# Altium schematic sheet Cooling_Control_2.SchDoc
size A4; SheetNumber: 7; SheetTotal: 7
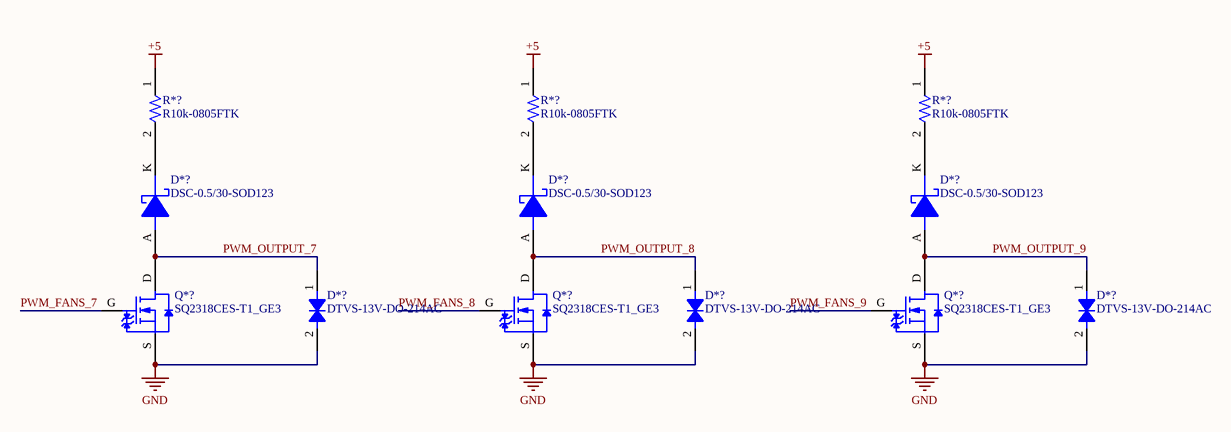
[diagram p0: Cooling_Control_2.SchDoc]

## Parts
(Parts that share a designator on the sheet are numbered #1, #2 ... from top to bottom, then left to right.)
D*?#1  DSC-0.5/30-SOD123  [DSC-SOD123]
D*?#2  DSC-0.5/30-SOD123  [DSC-SOD123]
D*?#3  DSC-0.5/30-SOD123  [DSC-SOD123]
D*?#4  DTVS-13V-DO-214AC  [DTVS-DO-214AC]
D*?#5  DTVS-13V-DO-214AC  [DTVS-DO-214AC]
D*?#6  DTVS-13V-DO-214AC  [DTVS-DO-214AC]
Q*?#1  SQ2318CES-T1_GE3  [SOT95P245X110-3N]
Q*?#2  SQ2318CES-T1_GE3  [SOT95P245X110-3N]
Q*?#3  SQ2318CES-T1_GE3  [SOT95P245X110-3N]
R*?#1  R10k-0805FTK  [R0805FTK]
R*?#2  R10k-0805FTK  [R0805FTK]
R*?#3  R10k-0805FTK  [R0805FTK]

## Nets
+5: R*?#1.1 R*?#2.1 R*?#3.1
GND: D*?#4.2 D*?#5.2 D*?#6.2 Q*?#1.S Q*?#2.S Q*?#3.S
PWM_FANS_7: Q*?#1.G
PWM_FANS_8: Q*?#2.G
PWM_FANS_9: Q*?#3.G
PWM_OUTPUT_7: D*?#1.A D*?#4.1 Q*?#1.D
PWM_OUTPUT_8: D*?#2.A D*?#5.1 Q*?#2.D
PWM_OUTPUT_9: D*?#3.A D*?#6.1 Q*?#3.D
NetD*?#1_K: D*?#1.K R*?#1.2
NetD*?#2_K: D*?#2.K R*?#2.2
NetD*?#3_K: D*?#3.K R*?#3.2

## Library data of the parts
D*?#1-D*?#3 = CMP-00165-1: VR=30V IF=500mA 30pF P=410mW; Max Reverse Leakage Current: 130uA; .Creator: GP; Max Reverse Voltage (DC): 30V; Element Configuration: Single; Average Rectified Current: 500mA; Peak Non-Repetitive Surge Current: 5.5A; Polarity: Standard; Forward Voltage: 430mV; ComponentLink10Description: https://datasheet.ciiva.com/910/mbr0530-910518.pdf?src-supplier=Digi-Key; ComponentLink1Description: Datasheet; Category: Diode; ComponentLink3Description: https://datasheet.ciiva.com/30479/0900766b810e2512-30479401.pdf?src-supplier=RSComponents; ComponentLink5Description: https://datasheet.ciiva.com/910/mbr0530-910516.pdf?src-supplier=Digi-Key; Stock 1: 9; Weight: 0.03g; Source: Filter components.SchLib; ComponentLink2Description: Where buy it; Series: -; Mount: Surface Mount; Max Repetitive Reverse Voltage (Vrrm): 30V; Pricing 1: 1=0,34400, 10=0,23900, 100=0,12200, 500=0,10000 (USD); Design Item ID: DSC-0.5/30-SOD123; ComponentLink8Description: https://datasheet.ciiva.com/17318/mbr0530-17318568.pdf?src-supplier=Future+Electronics; Current Rating: 500mA; ComponentLink1URL: *; Length: 2.7mm; Max Reverse Current: 130uA; ComponentLink7URL: https://datasheet.ciiva.com/8300/mbr0530-8300905.pdf?src-supplier=Avnet; ComponentLink9URL: https://datasheet.ciiva.com/15144/getdatasheetpartid-86760-15144598.pdf?src-supplier=Verical; Radiation Hardening: No; Height: 1.03mm; ComponentLink4Description: https://datasheet.ciiva.com/34301/974753-34301826.pdf?src-supplier=Jameco; ComponentLink7Description: https://datasheet.ciiva.com/8300/mbr0530-8300905.pdf?src-supplier=Avnet; Package Quantity: 1; Forward Current: 500mA; ComponentLink5URL: https://datasheet.ciiva.com/910/mbr0530-910516.pdf?src-supplier=Digi-Key; Max Surge Current: 5.5A; Lead Free: Lead Free; ComponentLink2URL: *; Max Forward Surge Current (Ifsm): 5.5A; Output Current: 500mA; Voltage Rating (DC): 30V; Contact Plating: Tin,Matte; RoHS Compliant: Yes; REACH SVHC: No SVHC; ComponentLink10URL: https://datasheet.ciiva.com/910/mbr0530-910518.pdf?src-supplier=Digi-Key; ComponentLink4URL: https://datasheet.ciiva.com/34301/974753-34301826.pdf?src-supplier=Jameco; ComponentLink6URL: https://datasheet.ciiva.com/25931/mbr0530-25931989.pdf?src-supplier=Avnet+Europe; ComponentLink6Description: https://datasheet.ciiva.com/25931/mbr0530-25931989.pdf?src-supplier=Avnet+Europe; Width: 1.6mm; ComponentLink3URL: https://datasheet.ciiva.com/30479/0900766b810e2512-30479401.pdf?src-supplier=RSComponents; ComponentLink9Description: https://datasheet.ciiva.com/15144/getdatasheetpartid-86760-15144598.pdf?src-supplier=Verical; ComponentLink8URL: https://datasheet.ciiva.com/17318/mbr0530-17318568.pdf?src-supplier=Future+Electronics
D*?#4-D*?#6 = CMP-00155-1: Tvs Diode, 400W, 13V, Bidir, DO-214AC; Manufacturer Part Number: 824501131; Manufacturer: Wurth Electronics; Peak Pulse Current: 18.6A; Power Line Protection: No; .Creator: DO; Forward Voltage: 15.15V; Polarity: Bidirectional; Number of Bidirectional Channels: 1; Clamping Voltage: 21.5V; Max Operating Temperature: 150°C; Category: TVS Diodes; Stock 1: 1000; RoHS: Yes; ComponentLink3Description: Where buy it; Source: Filter components.SchLib; Design Item ID: DTVS-13V-DO-214AC; REACH SVHC: Unknown; Min Operating Temperature: -65°C; Resistor Type: Zener; ComponentLink2Description: http://www.farnell.com/datasheets/2036399.pdf?src-supplier=Element14; Peak Pulse Power: 400W; ComponentLink1URL: https://katalog.we-online.de/pbs/datasheet/824501131.pdf?src-supplier=Digi-Key; Packaging: Cut Tape; ComponentLink2URL: http://www.farnell.com/datasheets/2036399.pdf?src-supplier=Element14; ComponentLink3URL: https://www.we-online.com/catalog/en/WE-TVSP?sq=824501131#824501131; RoHS Compliant: Yes; Reverse Standoff Voltage: 13V; Mount: Surface Mount; Min Breakdown Voltage: 15.15V; ComponentLink1Description: https://katalog.we-online.de/pbs/datasheet/824501131.pdf?src-supplier=Digi-Key; Pricing 1: 1=0,27000 (USD); Pins: 2
Q*?#1-Q*?#3 = CMP-013-00002-1: Mosfet, N-channel, 40V, 7A, SOT-23 Rohs Compliant: Yes
R*?#1-R*?#3 = CMP-00085-1: BOURNS         CR0805-JW-103ELF            Surface Mount Chip Resistor, Thick Film, CR Series, 10 kohm, 125 mW,  5%, 150 V; .Creator: DR; Power Rating: 125mW; Voltage Rating (DC): 100V; Voltage Rating: 150V; Temperature Coefficient: 200ppm/°C; Value: 10k; ComponentLink6URL: https://datasheet.ciiva.com/16783/70154685-16783482.pdf?src-supplier=Allied+Electronics; Manufacturer 1: Bourns; Package Quantity: 1; ComponentLink10URL: https://datasheet.ciiva.com/7985/1856384-7985869.pdf?src-supplier=Element14; Technology: THICK FILM; Source: Passives.SchLib; RoHS Compliant: Yes; ComponentLink10Description: https://datasheet.ciiva.com/7985/1856384-7985869.pdf?src-supplier=Element14; ComponentLink1URL: https://datasheet.ciiva.com/11821/0900766b80fcdb72-11821135.pdf?src-supplier=RSComponents; ComponentLink7Description: https://datasheet.ciiva.com/5548/chpreztr-5548491.pdf?src-supplier=Mouser; Radiation Hardening: No; Design Item ID: R10k-0805FTK; ComponentLink4Description: https://datasheet.ciiva.com/7986/691949-7986187.pdf?src-supplier=Element14; Pins: 2; ComponentLink9URL: https://datasheet.ciiva.com/6559/chpreztr-6559901.pdf?src-supplier=Digi-Key; Resistor Type: Thick Film; ComponentLink4URL: https://datasheet.ciiva.com/7986/691949-7986187.pdf?src-supplier=Element14; Contact Plating: Tin; Case Code (Metric): 2012; Military Standard: Not; Depth: 1.25mm; Case/Package: 0805; Packaging: Tape and Reel; ComponentLink9Description: https://datasheet.ciiva.com/6559/chpreztr-6559901.pdf?src-supplier=Digi-Key; Construction: Rectangular; Pricing 1: 1=0,05790, 10=0,01540, 25=0,01340, 100=0,00340 (USD); ComponentLink7URL: https://datasheet.ciiva.com/5548/chpreztr-5548491.pdf?src-supplier=Mouser; Category: Chip SMD Resistors; Length: 2mm; Max Operating Temperature: 155°C; Resistance Tolerance: 5%; Manufacturer Part Number 1: CR0805-JW-103ELF; Height: 0.5mm; ComponentLink2URL: https://datasheet.ciiva.com/9122/chpreztr-9122374.pdf?src-supplier=Avnet; Thickness: 508um; Max Power Dissipation: 125mW; ComponentLink8Description: https://datasheet.ciiva.com/6559/chpreztr-6559900.pdf?src-supplier=Digi-Key; REACH SVHC: No SVHC; ComponentLink8URL: https://datasheet.ciiva.com/6559/chpreztr-6559900.pdf?src-supplier=Digi-Key; ComponentLink5URL: https://datasheet.ciiva.com/30065/159chpreztr-30065976.pdf?src-supplier=Onlinecomponents.com; Width: 1.25mm; ComponentLink11URL: https://datasheet.ciiva.com/48692/001055517-da-01-en-smd-wid-cr0805-jw-103elf-10k-ohm-1-8w-48692118.pdf?src-supplier=Conrad; ComponentLink3Description: https://datasheet.ciiva.com/22693/1902866-22693254.pdf?src-supplier=Element14; ComponentLink11Description: https://datasheet.ciiva.com/48692/001055517-da-01-en-smd-wid-cr0805-jw-103elf-10k-ohm-1-8w-48692118.pdf?src-supplier=Conrad; ComponentLink1Description: https://datasheet.ciiva.com/11821/0900766b80fcdb72-11821135.pdf?src-supplier=RSComponents; ComponentLink2Description: https://datasheet.ciiva.com/9122/chpreztr-9122374.pdf?src-supplier=Avnet; Stock 1: 57566; Min Operating Temperature: -55°C; Series: CR0805; Number of Terminations: 2; Termination: SMD/SMT; Tolerance: 5%; Mount: Surface Mount; ComponentLink6Description: https://datasheet.ciiva.com/16783/70154685-16783482.pdf?src-supplier=Allied+Electronics; ComponentLink5Description: https://datasheet.ciiva.com/30065/159chpreztr-30065976.pdf?src-supplier=Onlinecomponents.com; RoHS: Yes; Features: Moisture Resistant; ComponentLink3URL: https://datasheet.ciiva.com/22693/1902866-22693254.pdf?src-supplier=Element14